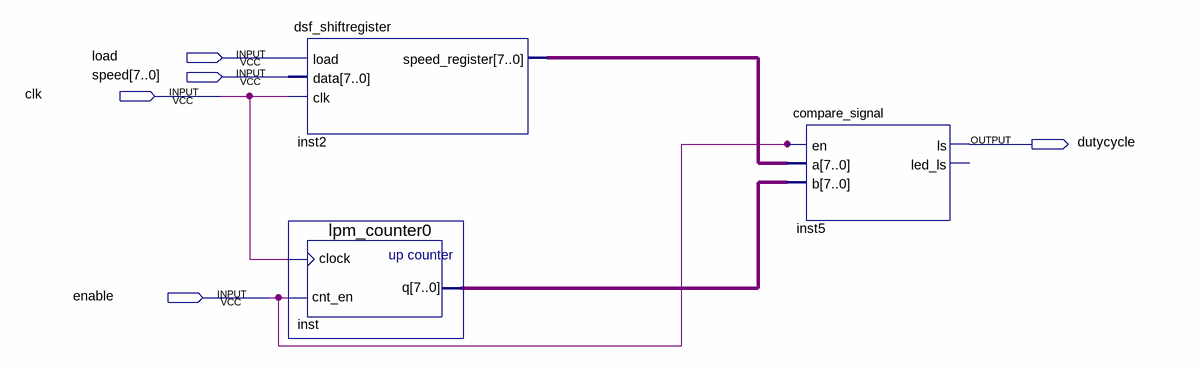
[diagram p0: schematic sheet]
// Quartus schematic pwm.bdf as structural Verilog: 3 symbols, 5 pins
module pwm (
  input  load,
  input  [7:0] speed,
  input  clk,
  input  enable,
  output dutycycle
);

  wire [7:0] inst2_speed_register, inst_q;

  dsf_shiftregister inst2 (.load(load), .data(speed), .clk(clk), .speed_register(inst2_speed_register));
  lpm_counter0 inst (.clock(clk), .cnt_en(enable), .q(inst_q));
  compare_signal inst5 (.en(enable), .a(inst2_speed_register), .b(inst_q), .ls(dutycycle));  // open: led_ls
endmodule
